# EAGLE schematic spinner (EAGLE 9.5.2)
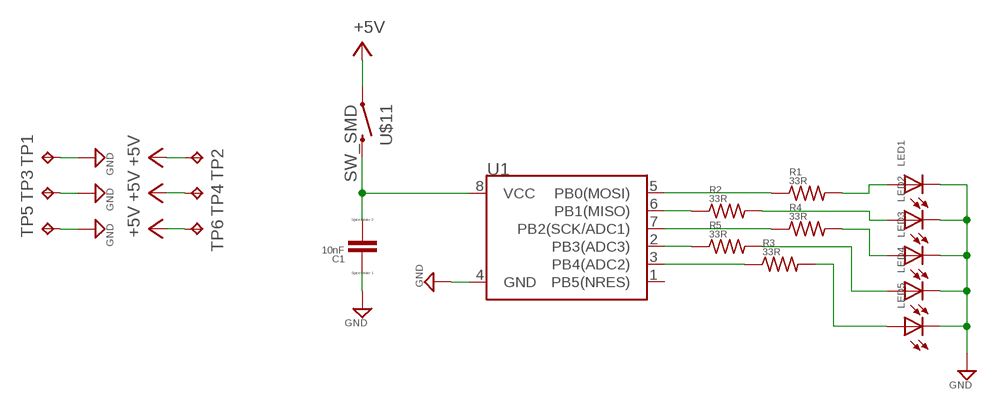
[diagram p0: schematic, sheet 1]

## Parts
C1  10nF  CAPACITOR-CERAMICOB  [0603]
LED1  LEDC  [0603LED]
LED2  LEDC  [0603LED]
LED3  LEDC  [0603LED]
LED4  LEDC  [0603LED]
LED5  LEDC  [0603LED]
R1  33R  RESISTORB  [0603]
R2  33R  RESISTORB  [0603]
R3  33R  RESISTORB  [0603]
R4  33R  RESISTORB  [0603]
R5  33R  RESISTORB  [0603]
TP1  TPB1,27  [B1,27]
TP2  TPB1,27  [B1,27]
TP3  TPB1,27  [B1,27]
TP4  TPB1,27  [B1,27]
TP5  TPB1,27  [B1,27]
TP6  TPB1,27  [B1,27]
U1  Tiny85-20-SMT  ATTINY45  [SO08-EIAJ]
U$11  SW_SMD  [SW_SMD]

## Nets
+5V: TP2.TP TP4.TP TP6.TP U$11.1
GND: C1.1 LED1.K(C) LED2.K(C) LED3.K(C) LED4.K(C) LED5.K(C) TP1.TP TP3.TP TP5.TP U1.4(GND)
N$1: R1.1 U1.5(PB0(MOSI))
N$2: R2.1 U1.6(PB1(MISO))
N$3: R3.1 U1.3(PB4(ADC2))
N$4: R5.1 U1.2(PB3(ADC3))
N$5: LED1.A R1.2
N$6: LED2.A R2.2
N$7: LED3.A R4.2
N$8: LED4.A R5.2
N$9: LED5.A R3.2
N$10: R4.1 U1.7(PB2(SCK/ADC1))
N$11: C1.2 U1.8(VCC) U$11.2
Unconnected: U1.1(PB5(NRES))

## Library data of the parts
C1 = sisoft:CAPACITOR-CERAMICO: Capacitor Ceramico
LED1-LED5 = sisoft:LED: LED estándar
R1-R5 = sisoft:RESISTOR: Resistencia SMD/TH
TP1-TP6 = testpad:TP: Test pad
U1 = SparkFun-DigitalIC:ATTINY45: Atmel 8-pin 2/4/8kB flash uC
U$11 = sisoft:SW_SMD